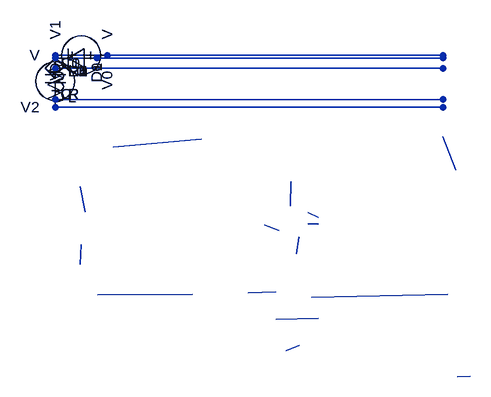
[diagram p0: schematic try2..asc]
try2..asc, the LTspice schematic file:
Version 4
SHEET 1 880 680
WIRE -1 -21 596 -21
WIRE -1 59 596 59
WIRE -1 -1 596 -1
WIRE -1 -1 596 -1
WIRE -1 -17 596 -17
WIRE -1 47 596 47
WIRE -1 -21 596 -21
WIRE -1 59 596 59
WIRE -1 -17 596 -17
WIRE -1 47 596 47
WIRE -1 -21 596 -21
WIRE -1 59 596 59
WIRE -1 -1 596 -1
WIRE -1 -1 596 -1
WIRE -1 -1 596 -1
WIRE -1 -1 596 -1
WIRE -1 -1 596 -1
WIRE -1 -1 596 -1
WIRE -1 -1 596 -1
WIRE -1 -1 596 -1
WIRE -1 -21 596 -21
WIRE -1 59 596 59
WIRE -1 -21 596 -21
WIRE -1 59 596 59
WIRE -1 -21 596 -21
WIRE -1 59 596 59
WIRE -1 -17 596 -17
WIRE -1 47 596 47
WIRE -1 -21 596 -21
WIRE -1 59 596 59
WIRE -1 -21 596 -21
WIRE -1 59 596 59
WIRE -1 -21 596 -21
WIRE -1 59 596 59
WIRE -1 -21 596 -21
WIRE -1 59 596 59
WIRE -1 -21 596 -21
WIRE -1 59 596 59
WIRE -1 -17 596 -17
WIRE -1 47 596 47
WIRE 638 473 618 474
WIRE 375 426 354 434
WIRE 339 386 404 384
WIRE 210 347 64 348
WIRE 339 343 296 345
WIRE 603 347 393 352
WIRE 37 301 39 270
WIRE 370 285 374 259
WIRE 404 239 388 239
WIRE 321 240 343 249
WIRE 388 221 404 229
WIRE 37 181 45 220
WIRE 362 173 361 211
WIRE 224 108 88 120
WIRE 596 104 616 156
SYMBOL voltage 95 -21 R90
SYMATTR InstName V0
FLAG -1 -1 0
SYMBOL cap -17 -17 R0
SYMATTR InstName C0
SYMBOL voltage -17 -21 R270
SYMATTR InstName V1
SYMBOL cap -17 -17 R0
SYMATTR InstName C1
SYMBOL voltage -1 75 R180
SYMATTR InstName V2
FLAG -1 -1 0
FLAG -1 -1 0
FLAG -1 -1 0
FLAG -1 -1 0
SYMBOL res -17 -37 R0
SYMATTR InstName R0
SYMBOL res -17 -37 R0
SYMATTR InstName R1
SYMBOL res -17 -37 R0
SYMATTR InstName R2
SYMBOL diode 63 -33 R90
SYMATTR InstName D0
SYMBOL res -17 -37 R0
SYMATTR InstName R3
SYMBOL res -17 -37 R0
SYMATTR InstName R4
SYMBOL res -17 -37 R0
SYMATTR InstName R5
SYMBOL res -17 -37 R0
SYMATTR InstName R6
SYMBOL ind -17 -37 R0
SYMATTR InstName L0
SYMBOL diode 63 -33 R90
SYMATTR InstName D1

The netlist it stands for:
* try2..asc
V0 N001 N001 V
C0 N003 N004 C
V1 N001 N001 V
C1 N003 N004 C
V2 N002 N001 V
R0 N001 N002 R
R1 N001 N002 R
R2 N001 N002 R
D0 N003 N003 D
R3 N001 N002 R
R4 N001 N002 R
R5 N001 N002 R
R6 N001 N002 R
L0 N001 N002 L
D1 N003 N003 D
.model D D
.lib standard.dio
.backanno
.end